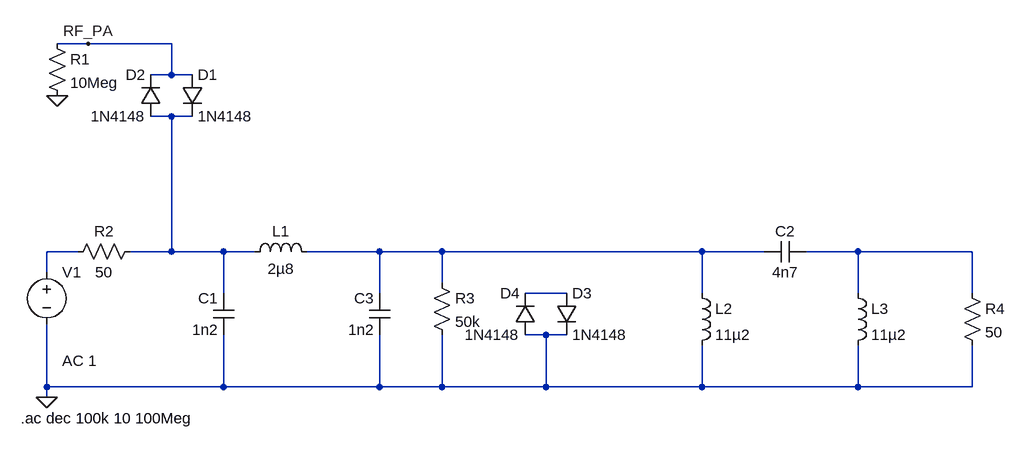
[diagram p0: schematic 2M7 Passive Switch Danny.asc]
2M7 Passive Switch Danny.asc, the LTspice schematic file:
Version 4
SHEET 1 1080 680
WIRE -336 -176 -384 -176
WIRE -208 -176 -336 -176
WIRE -208 -128 -208 -176
WIRE -208 -128 -240 -128
WIRE -176 -128 -208 -128
WIRE -208 -64 -240 -64
WIRE -176 -64 -208 -64
WIRE -352 144 -400 144
WIRE -208 144 -208 -64
WIRE -208 144 -272 144
WIRE -128 144 -208 144
WIRE -80 144 -128 144
WIRE 112 144 0 144
WIRE 208 144 112 144
WIRE 608 144 208 144
WIRE 704 144 608 144
WIRE 848 144 768 144
WIRE 1024 144 848 144
WIRE -400 176 -400 144
WIRE 208 192 208 144
WIRE -128 208 -128 144
WIRE 112 208 112 144
WIRE 400 208 336 208
WIRE 608 208 608 144
WIRE 848 208 848 144
WIRE 1024 208 1024 144
WIRE 368 272 336 272
WIRE 400 272 368 272
WIRE -400 352 -400 256
WIRE -128 352 -128 272
WIRE -128 352 -400 352
WIRE 112 352 112 272
WIRE 112 352 -128 352
WIRE 208 352 208 272
WIRE 208 352 112 352
WIRE 368 352 368 272
WIRE 368 352 208 352
WIRE 608 352 608 288
WIRE 608 352 368 352
WIRE 848 352 848 288
WIRE 848 352 608 352
WIRE 1024 352 1024 288
WIRE 1024 352 848 352
WIRE -400 368 -400 352
FLAG -400 368 0
FLAG -336 -176 RF_PA
FLAG -384 -96 0
SYMBOL ind -96 160 R270
WINDOW 0 32 56 VTop 2
WINDOW 3 5 56 VBottom 2
SYMATTR InstName L1
SYMATTR Value 2µ8
SYMATTR SpiceLine Rser=0.3
SYMBOL cap -112 272 R180
WINDOW 0 24 56 Left 2
WINDOW 3 24 8 Left 2
SYMATTR InstName C1
SYMATTR Value 1n2
SYMATTR SpiceLine Rser=0.1
SYMBOL voltage -400 160 R0
WINDOW 123 24 152 Left 2
WINDOW 39 24 124 Left 2
SYMATTR Value2 AC 1
SYMATTR InstName V1
SYMATTR Value ""
SYMBOL res -256 128 R90
WINDOW 0 0 56 VBottom 2
WINDOW 3 32 56 VTop 2
SYMATTR InstName R2
SYMATTR Value 50
SYMBOL cap 128 272 R180
WINDOW 0 24 56 Left 2
WINDOW 3 24 8 Left 2
SYMATTR InstName C3
SYMATTR Value 1n2
SYMATTR SpiceLine Rser=0.1
SYMBOL res 192 176 R0
SYMATTR InstName R3
SYMATTR Value 50k
SYMBOL diode -192 -128 R0
SYMATTR InstName D1
SYMATTR Value 1N4148
SYMATTR Description Schottky diode
SYMATTR Type schottky
SYMBOL diode -224 -64 R180
WINDOW 0 24 64 Left 2
WINDOW 3 24 0 Left 2
SYMATTR InstName D2
SYMATTR Value 1N4148
SYMATTR Description Schottky diode
SYMATTR Type schottky
SYMBOL res -400 -192 R0
SYMATTR InstName R1
SYMATTR Value 10Meg
SYMBOL diode 384 208 R0
SYMATTR InstName D3
SYMATTR Value 1N4148
SYMATTR Description Schottky diode
SYMATTR Type schottky
SYMBOL diode 352 272 R180
WINDOW 0 24 64 Left 2
WINDOW 3 24 0 Left 2
SYMATTR InstName D4
SYMATTR Value 1N4148
SYMATTR Description Schottky diode
SYMATTR Type schottky
SYMBOL ind 592 192 R0
SYMATTR InstName L2
SYMATTR Value 11µ2
SYMATTR SpiceLine Rser=0.3
SYMBOL ind 832 192 R0
SYMATTR InstName L3
SYMATTR Value 11µ2
SYMATTR SpiceLine Rser=0.3
SYMBOL cap 704 160 R270
WINDOW 0 32 32 VTop 2
WINDOW 3 0 32 VBottom 2
SYMATTR InstName C2
SYMATTR Value 4n7
SYMATTR SpiceLine Rser=0.1
SYMBOL res 1008 192 R0
SYMATTR InstName R4
SYMATTR Value 50
TEXT -440 400 Left 2 !.ac dec 100k 10 100Meg

The netlist it stands for:
* 2M7 Passive Switch Danny.asc
L1 N001 N003 2µ8 Rser=0.3
C1 0 N001 1n2 Rser=0.1
V1 N002 0 AC 1
R2 N001 N002 50
C3 0 N003 1n2 Rser=0.1
R3 N003 0 50k
D1 RF_PA N001 1N4148
D2 N001 RF_PA 1N4148
R1 RF_PA 0 10Meg
D3 N005 0 1N4148
D4 0 N005 1N4148
L2 N003 0 11µ2 Rser=0.3
L3 N004 0 11µ2 Rser=0.3
C2 N003 N004 4n7 Rser=0.1
R4 N004 0 50
.model D D
.lib standard.dio
.ac dec 100k 10 100Meg
.backanno
.end